# EAGLE board FilterSchematic_REV3 (EAGLE 8.2.2)
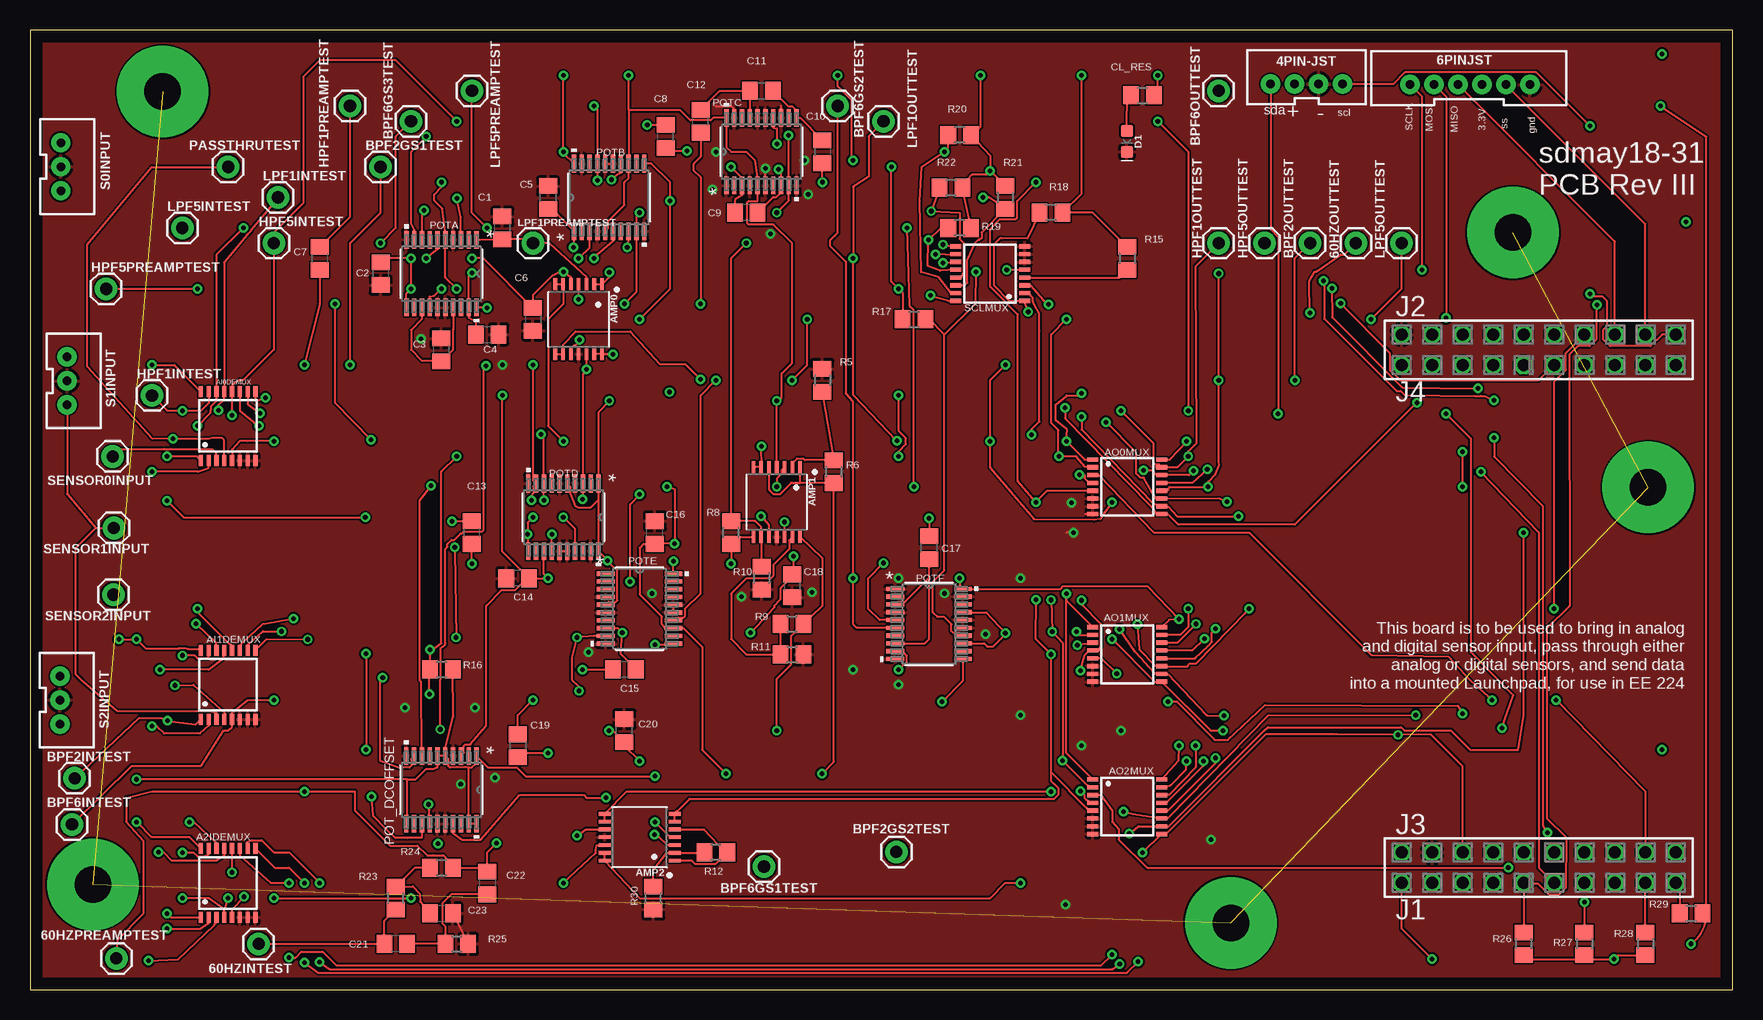
[diagram p2: board, top side]
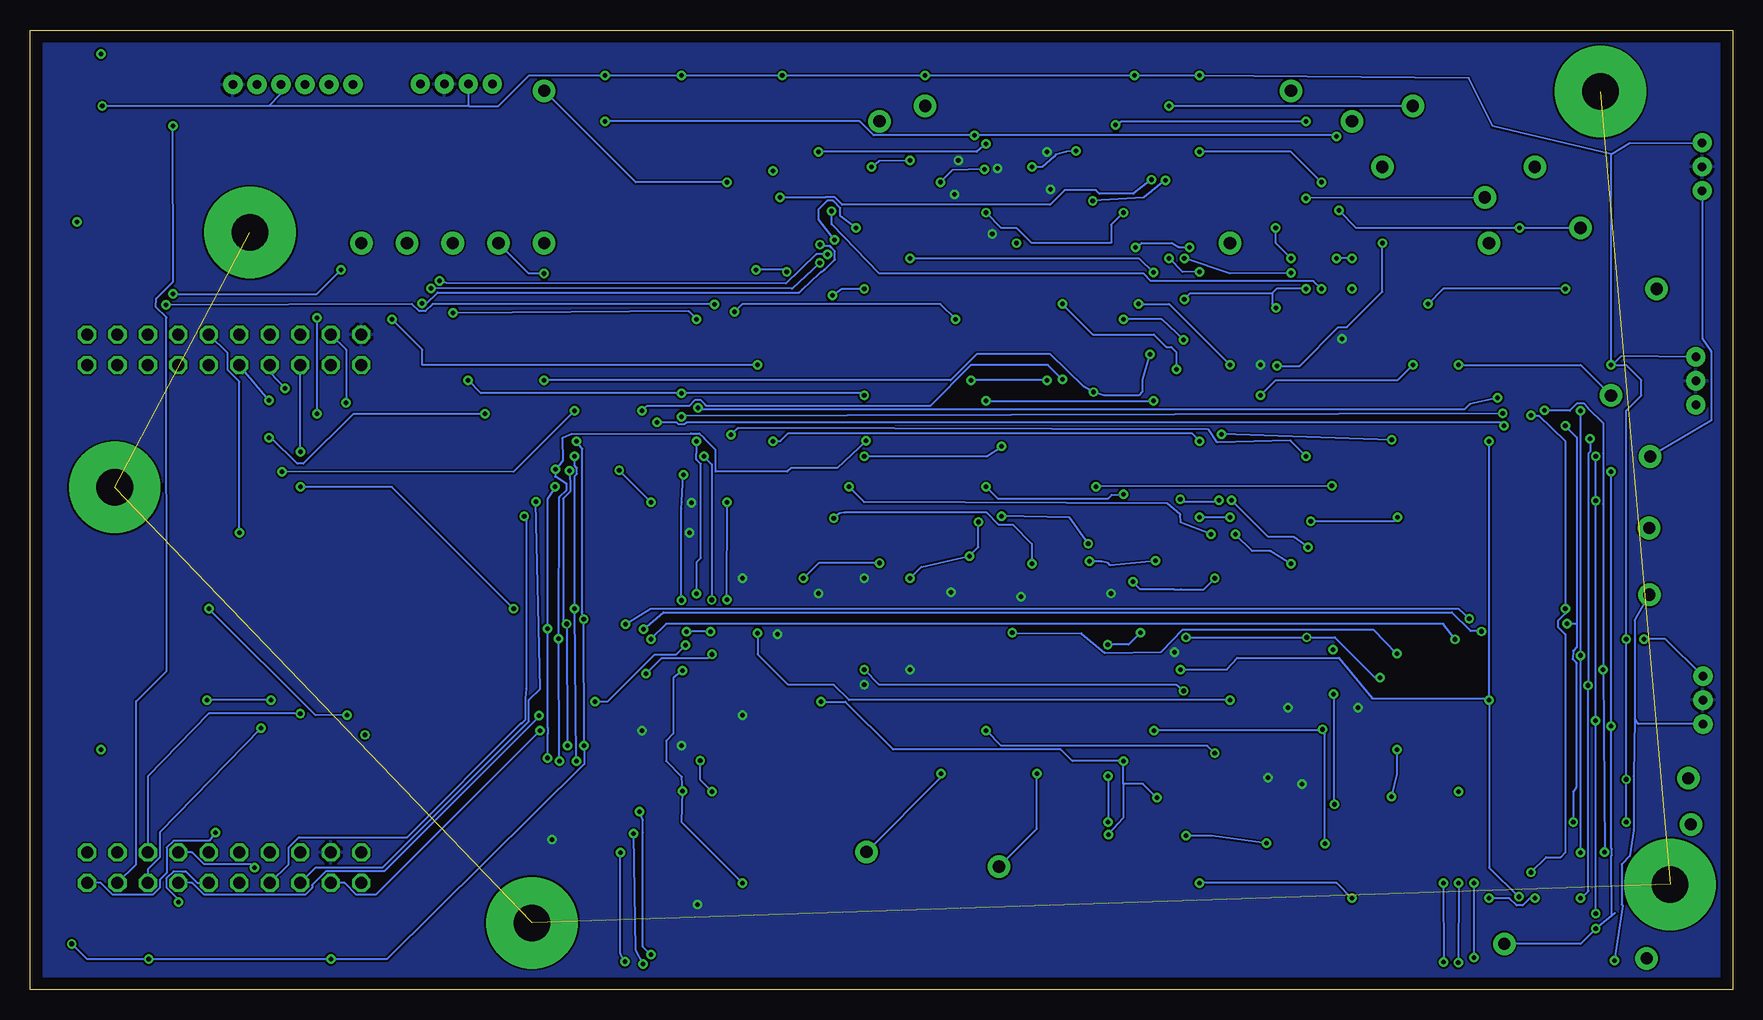
[diagram p3: board, bottom side, seen from below]

Size 141.91 x 80 mm. Coordinates in mm from the lower left corner, seen from the top.
Outline: 0,0 141.91,0 141.91,80 0,80 0,0
Copper layers (1*16): Top 0.035mm / dielectric 1.5mm / Bottom 0.035mm
Design rules "default": minimum track width 6mil, minimum drill 0.35mm, track to track 6mil, track to pad 6mil, pad to pad 6mil, via to via 6mil, smd to smd 6mil, copper to edge 40mil, drill to drill 6mil, minimum pad ring 10mil, minimum via ring 8mil, stop-mask expansion 4mil, vias tented up to drill 0mil, thermal gap 10mil

## Footprints (pad centres in the part's own frame; a part is rotated, then mirrored left to right if it is on the bottom)
1X01 = drill 1.016 pad 1.88: 1 0,0
TSSOP16 = smd 0.9 x 0.35: 1 -2.875,2.275; 2 -2.875,1.625; 3 -2.875,0.975; 4 -2.875,0.325; 5 -2.875,-0.325; 6 -2.875,-0.975; 7 -2.875,-1.625; 8 -2.875,-2.275; 9 2.875,-2.275; 10 2.875,-1.625; 11 2.875,-0.975; 12 2.875,-0.325; 13 2.875,0.325; 14 2.875,0.975; 15 2.875,1.625; 16 2.875,2.275
TSSOP14 = smd 0.305 x 0.991: 1 -1.95,-2.918; 2 -1.3,-2.918; 3 -0.65,-2.918; 4 0,-2.918; 5 0.65,-2.918; 6 1.3,-2.918; 7 1.95,-2.918; 8 1.95,2.918; 9 1.3,2.918; 10 0.65,2.918; 11 0,2.918; 12 -0.65,2.918; 13 -1.3,2.918; 14 -1.95,2.918
C0805 = smd 1.3 x 1.5: 1 -0.95,0; 2 0.95,0
R0805 = smd 1.3 x 1.5: 1 -0.95,0; 2 0.95,0
LED-0603 = smd 1 x 1: A -0.877,0; C 0.877,0
RU_20 = smd 1.473 x 0.356: 1 -2.819,2.925; 2 -2.819,2.275; 3 -2.819,1.625; 4 -2.819,0.975; 5 -2.819,0.325; 6 -2.819,-0.325; 7 -2.819,-0.975; 8 -2.819,-1.625; 9 -2.819,-2.275; 10 -2.819,-2.925; 11 2.819,-2.925; 12 2.819,-2.275; 13 2.819,-1.625; 14 2.819,-0.975; 15 2.819,-0.325; 16 2.819,0.325; 17 2.819,0.975; 18 2.819,1.625; 19 2.819,2.275; 20 2.819,2.925
JST-3-PTH-VERT = drill 0.7 pad 1.6: 1 -2,-0.55; 2 0,-0.55; 3 2,-0.55
JST-6-PTH-VERT = drill 0.7 pad 1.6: 1 -3,-0.55; 2 -1,-0.55; 3 1,-0.55; 4 3,-0.55; 5 4.999,-0.547; 6 6.999,-0.547
JST-4-PTH-VERT = drill 0.7 pad 1.6: 1 -3,-0.55; 2 -1,-0.55; 3 1,-0.55; 4 3,-0.55
SSW-110-02-S-D = drill 1 pad 1.5 octagon: 1 -22.86,11.43; 2 -20.32,11.43; 3 -22.86,8.89; 4 -20.32,8.89; 5 -22.86,6.35; 6 -20.32,6.35; 7 -22.86,3.81; 8 -20.32,3.81; 9 -22.86,1.27; 10 -20.32,1.27; 11 -22.86,-1.27; 12 -20.32,-1.27; 13 -22.86,-3.81; 14 -20.32,-3.81; 15 -22.86,-6.35; 16 -20.32,-6.35; 17 -22.86,-8.89; 18 -20.32,-8.89; 19 -22.86,-11.43; 20 -20.32,-11.43; 21 20.32,11.43; 22 22.86,11.43; 23 20.32,8.89; 24 22.86,8.89; 25 20.32,6.35; 26 22.86,6.35; 27 20.32,3.81; 28 22.86,3.81; 29 20.32,1.27; 30 22.86,1.27; 31 20.32,-1.27; 32 22.86,-1.27; 33 20.32,-3.81; 34 22.86,-3.81; 35 20.32,-6.35; 36 22.86,-6.35; 37 20.32,-8.89; 38 22.86,-8.89; 39 20.32,-11.43; 40 22.86,-11.43

## Placement (x,y rotation side)
60HZINTEST  [1X01]  19.05,3.81 180 top
60HZOUTTEST  [1X01]  110.49,62.23 90 top
60HZPREAMPTEST  [1X01]  7.19,2.6 90 top
A2IDEMUX  CD74HC4051-Q1  [TSSOP16]  16.51,8.89 90 top
AI0DEMUX  CD74HC4051-Q1  [TSSOP16]  16.51,46.99 90 top
AI1DEMUX  CD74HC4051-Q1  [TSSOP16]  16.51,25.4 90 top
AMP0  OPA4830  [TSSOP14]  45.72,55.88 180 top
AMP1  OPA4830  [TSSOP14]  62.23,40.64 180 top
AMP2  OPA4830  [TSSOP14]  50.8,12.7 90 top
AO0MUX  CD74HC4051-Q1  [TSSOP16]  91.44,41.91 0 top
AO1MUX  CD74HC4051-Q1  [TSSOP16]  91.44,27.94 0 top
AO2MUX  CD74HC4051-Q1  [TSSOP16]  91.44,15.24 0 top
BPF2GS1TEST  [1X01]  29.21,68.58 0 top
BPF2GS2TEST  [1X01]  72.2,11.47 0 top
BPF2INTEST  [1X01]  3.72,17.61 90 top
BPF2OUTTEST  [1X01]  106.68,62.23 90 top
BPF6GS1TEST  [1X01]  61.17,10.25 0 top
BPF6GS2TEST  [1X01]  67.31,73.66 0 top
BPF6GS3TEST  [1X01]  31.75,72.39 0 top
BPF6INTEST  [1X01]  3.5,13.76 90 top
BPF6OUTTEST  [1X01]  99.06,74.93 90 top
C1  68n  [C0805]  39.37,63.5 90 top
C2  68n  [C0805]  29.21,59.69 270 top
C3  68n  [C0805]  34.29,53.34 90 top
C4  68n  [C0805]  38.1,54.61 0 top
C5  68n  [C0805]  43.18,66.04 90 top
C6  68n  [C0805]  41.91,55.88 270 top
C7  130n  [C0805]  24.13,60.96 270 top
C8  130n  [C0805]  52.96,71.12 90 top
C9  130n  [C0805]  59.69,64.77 180 top
C10  130n  [C0805]  66.04,69.85 270 top
C11  130n  [C0805]  60.96,74.93 0 top
C12  130n  [C0805]  55.88,72.39 90 top
C13  91n  [C0805]  36.83,38.1 90 top
C14  91n  [C0805]  40.64,34.29 180 top
C15  91n  [C0805]  49.53,26.67 180 top
C16  91n  [C0805]  52.07,38.1 90 top
C17  91n  [C0805]  74.93,36.83 90 top
C18  91n  [C0805]  63.5,33.66 270 top
C19  91n  [C0805]  40.64,20.32 270 top
C20  18n  [C0805]  49.53,21.59 90 top
C21  5.6u  [C0805]  30.48,3.81 180 top
C22  5.6u  [C0805]  38.1,8.89 270 top
C23  10u  [C0805]  34.29,6.35 0 top
CL_RES  120  [R0805]  92.71,74.55 0 top
D1  Ind  [LED-0603]  91.41,70.71 270 top
HPF1INTEST  [1X01]  10.16,49.53 0 top
HPF1OUTTEST  [1X01]  99.06,62.23 90 top
HPF1PREAMPTEST  [1X01]  26.67,73.66 0 top
HPF5INTEST  [1X01]  20.32,62.23 0 top
HPF5OUTTEST  [1X01]  102.87,62.23 90 top
HPF5PREAMPTEST  [1X01]  6.35,58.42 0 top
LPF1INTEST  [1X01]  20.67,66.04 0 top
LPF1OUTTEST  [1X01]  71.12,72.39 0 top
LPF1PREAMPTEST  [1X01]  41.91,62.23 0 top
LPF5INTEST  [1X01]  12.7,63.5 0 top
LPF5OUTTEST  [1X01]  114.3,62.23 90 top
LPF5PREAMPTEST  [1X01]  36.83,74.93 0 top
PASSTHRUTEST  [1X01]  16.51,68.58 0 top
POT_DCOFFSET  AD5254BRUZ10-RL7  [RU_20]  34.28,16.65 270 top
POTA  AD5254BRUZ10-RL7  [RU_20]  34.29,59.69 270 top
POTB  AD5254BRUZ10-RL7  [RU_20]  48.26,66.04 90 top
POTC  AD5254BRUZ10-RL7  [RU_20]  60.96,69.85 90 top
POTD  AD5254BRUZ10-RL7  [RU_20]  44.45,39.37 270 top
POTE  AD5254BRUZ10-RL7  [RU_20]  50.8,31.75 0 top
POTF  AD5254BRUZ10-RL7  [RU_20]  74.93,30.48 0 top
R5  1k  [R0805]  66.04,50.8 270 top
R6  2.7k  [R0805]  66.99,43.18 90 top
R8  3.3K  [R0805]  58.42,38.1 90 top
R9  2.7k  [R0805]  63.5,30.48 0 top
R10  1k  [R0805]  60.96,34.29 270 top
R11  1k  [R0805]  63.5,27.94 0 top
R12  2.7k  [R0805]  57.15,11.43 180 top
R15  1k  [R0805]  91.44,60.96 270 top
R16  1k  [R0805]  34.29,26.67 180 top
R17  1k  [R0805]  73.66,55.88 0 top
R18  1k  [R0805]  85.09,64.77 180 top
R19  1k  [R0805]  77.47,63.5 180 top
R20  1k  [R0805]  77.47,71.25 180 top
R21  1k  [R0805]  81.28,66.04 270 top
R22  1k  [R0805]  76.76,66.84 180 top
R23  470  [R0805]  30.48,7.62 90 top
R24  470  [R0805]  34.29,10.16 0 top
R25  220  [R0805]  35.56,3.81 0 top
R26  1k  [R0805]  124.46,3.81 270 top
R27  1k  [R0805]  129.54,3.81 270 top
R28  1k  [R0805]  134.62,3.81 270 top
R29  1k  [R0805]  138.43,6.35 0 top
R30  1k  [R0805]  51.94,7.62 90 top
S0INPUT  [JST-3-PTH-VERT]  3.12,68.6 270 top
S1INPUT  [JST-3-PTH-VERT]  3.64,50.74 270 top
S2INPUT  [JST-3-PTH-VERT]  3.05,24.13 270 top
SCLMUX  CD74HC4051-Q1  [TSSOP16]  80.01,59.69 180 top
SENSOR0INPUT  [1X01]  6.89,44.44 180 top
SENSOR1INPUT  [1X01]  6.99,38.48 180 top
SENSOR2INPUT  [1X01]  6.96,32.92 180 top
U$1  6PINJST  [JST-6-PTH-VERT]  118,76 0 top
U$2  4PIN-JST  [JST-4-PTH-VERT]  106.38,76.05 0 top
U$4  LAUNCHPAD_FOOTPRINT  [SSW-110-02-S-D]  125.73,31.75 90 top

## Tracks (layer width: path | path; a pad name or v marks a point on that pad's centre or on a via)
3.3V  (via drill 0.38)
  Top 0.152: A2IDEMUX.16 13.3,12.7 10.16,12.7 v8.89,13.97 | 8.91,29.19 v8.89,29.21 | 8.91,29.19 9.64,28.46 12.43,28.46 12.44,28.47 12.96,28.47 13.16,28.41 14.11,28.41 AI1DEMUX.16 | v10.16,52.07 12.03,52.07 AI0DEMUX.16 | v135.89,73.66 139.7,71.12 139.7,6.35 | 139.7,6.35 arc-53 v138.43,3.81 | v116.84,2.54 114.3,5.08 U$4.1 | 31.43,17.52 32.16,17.52 33.02,18.39 33.04,18.36 33.59,18.36 33.96,18.51 POT_DCOFFSET.6 POT_DCOFFSET.5 | 31.43,17.52 v8.89,17.52 | v52.07,17.78 41.3,17.78 40.59,18.49 38.18,18.49 POT_DCOFFSET.1 37.2,19.43 37.2,18.85 36.83,18.5 36.54,18.5 | v52.07,13.97 53.34,12.7 AMP2.4 | POTB.20 44.45,69.74 v44.45,69.85 v44.45,76.2 | 49.88,73.31 v49.88,76.2 | 49.88,73.31 POTB.13 49.88,67.67 49.53,67.31 49.53,65.4 48.18,64.05 48.18,63.46 POTB.5 | AO0MUX.16 94.98,44.19 v96.38,45.7 | v95.74,20.32 95.7,19.08 AO2MUX.16 | AO1MUX.16 94.92,30.82 v95.77,30.87 93.11,33.63 86.11,33.63 85.89,33.41 POTF.20 77.47,33.68 v77.47,34.29 | CL_RES.2 93.98,75.25 v93.98,76.2 | v79.22,76.2 79.22,71.92 R20.1 80.01,69.53 v80.01,68.26 | v87.63,76.2 87.63,66.36 R18.1 88.58,64.77 R15.1 | R19.1 R22.1 78.13,67.07 78.13,67.57 78.49,67.93 79.68,67.93 v80.01,68.26 | v38.08,56.85 POTA.20 | v45.72,57.54 AMP0.4 | v35.56,58.42 34.62,59.37 POTA.5 34.64,62.9 34.37,65.1 33.68,65.79 33.68,66.29 34.29,66.9 v34.29,67.31 | 124.47,2.85 R26.2 124.78,2.54 129.55,2.54 129.54,2.55 R27.2 129.86,2.54 v132.01,2.54 132.34,2.86 R28.2 134.56,2.79 | R16.1 35.29,22.81 34.63,20.21 34.62,19.57 34.62,19.49 POT_DCOFFSET.5 | 49.88,73.31 54.18,73.31 55.03,72.46 56.73,72.46 56.93,72.67 POTC.20 58.03,70.23 58.42,69.85 59.69,69.85 60.39,69.15 60.64,67.38 POTC.5 60.63,65.75 59.9,65.75 59.76,65.61 59.76,63.92 59.9,63.79 61.94,63.79 63.5,62.23 63.5,52.24 62.63,51.37 62.63,49.37 v62.23,49.08 AMP1.4
  Top 0.152: POTD.1 | POTD.1 47.38,40.82 | 47.38,40.82 POTD.20 47.98,35.95 v48.11,35.75 48.78,35.08 48.81,35.08 48.95,34.95 48.95,32.45 48.81,32.32 48.22,32.32 POTE.5 | POTD.5 45.02,41.95 45.02,41.36 45.43,40.31 45.71,40.19 46.72,40.19 47.38,40.82 | v48.27,49.08 47.38,48.08 POTD.1 | POTF.5 70.8,30.8 69.85,31.75 69.85,34.29 v71.12,35.56 | SCLMUX.16 76.89,57.38 76.59,57.38 75.22,57.76 v75.05,57.86 | R17.1 72.71,58.1 v72.39,58.42 71.78,59.03 v71.78,68.58 | v67.31,76.2 67.31,75.31 68.48,74.14 68.48,69.34 v68.58,69.13 | R21.1 v80.01,68.26 | R29.2 139.7,6.35 | v7.41,29.21 7.64,29.19 8.91,29.19 | POT_DCOFFSET.20 POT_DCOFFSET.19 36.54,13.84 36.54,18.5 | POT_DCOFFSET.5 34.85,19.23 34.85,18.64 34.98,18.5 36.54,18.5 | POTE.20 v53.62,35.69 | POT_DCOFFSET.11 31.43,13.9 31.43,17.52
  Bottom 0.152: v8.89,13.97 v8.89,17.52 v8.89,29.21 8.89,48.26 7.62,49.53 7.62,50.8 8.89,52.07 10.04,52.07 | 10.04,52.07 v10.16,52.07 10.16,69.66 | v138.43,3.81 137.16,2.54 v132.01,2.54 v116.84,2.54 112.17,2.54 95.72,18.79 v95.74,20.32 v95.77,30.87 95.91,31.46 95.89,31.49 95.89,45.09 v96.38,45.7 | v52.07,17.78 v52.07,13.97 | v62.23,49.08 v48.27,49.08 | v71.12,35.56 76.2,35.56 v77.47,34.29 | v75.05,57.86 74.27,58.42 v72.39,58.42 | v71.78,68.58 71.14,69.09 v68.58,69.13 | v34.29,67.31 36.83,69.85 v44.45,69.85 | v48.11,35.75 51.88,35.37 52.07,35.56 52.6,35.69 v53.62,35.69 | 38.39,58.05 45.21,58.05 v45.72,57.54 | v35.56,58.42 38.02,58.42 38.39,58.05 | 38.39,58.05 38.39,57.16 v38.08,56.85 | 105.31,73.66 122.01,73.66 | 105.31,73.66 102.87,73.66 100.33,76.2 v93.98,76.2 v87.63,76.2 v79.22,76.2 v67.31,76.2 v49.88,76.2 v44.45,76.2 22,76 20,72 10.16,69.66 | 122.01,73.66 v135.89,73.66 | S2INPUT.1 5.62,29.21 v7.41,29.21 | S1INPUT.1 9.31,52.8 10.04,52.07 | S0INPUT.1 8.63,70.58 10.16,69.66 | U$1.4 121,74.67 122.01,73.66 | U$2.2 105.38,73.72 105.31,73.66
60HZIN  (via drill 0.38)
  Top 0.152: v10.16,43.18 14,43.18 14.88,43.5 AI0DEMUX.2 | A2IDEMUX.2 14.89,5.8 14.89,5.5 14.25,5.08 v11.43,5.08 | AI1DEMUX.2 14.87,22.35 14.91,22.02 14.15,21.35 11.18,21.35 10.57,21.94 v10.16,21.96 | 60HZINTEST.1 C21.2 29.53,5.72 R23.1
  Bottom 0.152: 9.84,6.37 10.12,6.14 | 10.12,6.14 v11.43,5.08 12.7,3.81 60HZINTEST.1 | v10.16,43.18 v10.16,21.96 10.13,11.77 10.08,11.71 10.08,11.2 10.13,11.15 10.12,6.14
60HZOUT  (via drill 0.38)
  Top 0.152: AO0MUX.2 88.4,43.57 87.95,43.57 87.2,44.45 v85.75,44.45 85.7,44.51 85.7,46.63 85.09,47.24 85.09,54.61 v86.36,55.88 | v85.1,32.48 v85.19,29.84 86.06,28.91 v86.06,19.08 88.02,17.11 88.51,16.84 AO2MUX.2 | AMP2.9 AMP2.8 49.74,16.51 v85.09,16.51 | v87.2,29.82 87.33,29.57 AO1MUX.2 | 60HZOUTTEST.1 109.54,61.28 109.22,61.28 107.17,59.87 107.08,59.84 106.6,59.07 v106.65,56.41
  Bottom 0.152: v85.75,44.45 85.09,43.79 v85.1,32.48 | v85.09,16.51 86.06,17.48 v86.06,19.08 | v86.36,55.88 87.02,56.54 v106.65,56.41 | v85.19,29.84 87.18,29.84 v87.2,29.82
A0S0  (via drill 0.38)
  Top 0.152: AI0DEMUX.11 17.49,48.28 v19.07,46.98 | AO0MUX.11 94.02,40.94 | 94.02,40.94 94.04,40.91 99.1,40.94 v99.75,40.66 | 94.02,40.94 93.88,40.87 93.47,41.49 92.83,42.66 92.55,42.66 92.19,43.02 92.19,44.79 v89.67,47.3
  Bottom 0.152: U$4.5 118.09,10.18 112.52,10.18 100.33,22.37 100.33,24.13 99.41,25.05 v99.75,40.66 | v89.67,47.3 88.06,47.3 87.89,47.13 87.37,47.13 87.2,47.3 19.39,47.3 v19.07,46.98
A0S1  (via drill 0.38)
  Top 0.152: AI0DEMUX.10 18.14,48.81 v19.18,48.04 | v87.63,47.76 87.63,46.67 93.59,40.54 94.09,40.31 AO0MUX.10 94.56,40.27 94.86,40.27 95.59,39.45 v100.72,39.44
  Bottom 0.152: v19.18,48.04 87.47,47.81 v87.63,47.76 | v100.72,39.44 100.56,39.38 100.56,25.1 100.64,24.26 100.64,22.49 100.93,22.19 101,22.19 110.49,12.7 119.5,12.7 120.36,11.84 120.36,10.45 U$4.7
A0S2  (via drill 0.38)
  Top 0.152: AI0DEMUX.9 18.79,49.07 v19.62,49.33 | v86.26,48.51 86.26,47.61 93.3,40.4 93.64,40.02 93.85,39.65 94.15,39.65 AO0MUX.9 94.83,39.63 95.7,38.76 105.41,38.76 v115.57,48.92
  Bottom 0.152: v19.62,49.33 21.93,48.81 22.38,48.36 86.26,48.36 v86.26,48.51 | U$4.24 115.57,53.34 v115.57,48.92
A1S0  (via drill 0.38)
  Top 0.152: AI1DEMUX.11 17.49,28.7 17.73,28.94 19.4,30.49 v21.97,30.92 | v92.28,30.45 92.45,28.37 93.72,27.02 94.04,27 AO1MUX.11 94.54,26.96 96.5,26.96 96.62,27.19 97.18,27.19 101.34,31.47 101.34,31.49 v101.6,31.75 | v119.38,41.91 v119.38,44.83
  Bottom 0.152: v21.97,30.92 22.86,31.75 90.17,31.75 v92.28,30.45 | v101.6,31.75 111.76,41.91 v119.38,41.91 | v119.38,44.83 U$4.25
A1S1  (via drill 0.38)
  Top 0.152: AI1DEMUX.10 18.14,28.73 19.41,29.87 19.41,29.85 v20.95,29.85 | v99.49,22.83 98.07,22.86 94.82,26.31 94.52,26.31 AO1MUX.10 94.03,26.36 93.73,26.36 92.1,28.16 v90.79,30.04
  Bottom 0.152: v20.95,29.85 20.98,29.88 21.85,29.88 23.41,31.45 89.13,31.45 v90.79,30.04 | U$4.13 128.39,8.89 127.41,7.91 118.97,7.91 118.4,8.48 118.4,8.72 117.25,9.87 112.39,9.87 99.49,22.78 v99.49,22.83
A1S2  (via drill 0.38)
  Top 0.152: AI1DEMUX.9 19.72,29.21 v23.14,29.19 | v90.17,29.21 93.72,25.66 AO1MUX.9 98.39,21.59 v99.41,21.59
  Bottom 0.152: v23.14,29.19 24.13,30.48 88.9,30.48 v90.17,29.21 | U$4.3 115.69,8.89 114.71,7.91 113.09,7.91 v99.41,21.59
A2S0  (via drill 0.38)
  Top 0.152: A2IDEMUX.11 17.47,11.5 17.48,11.2 20.06,8.89 v21.59,8.89 | v21.59,2.66 22.13,2.66 22.61,3.15 24.38,3.15 25.52,2.01 89.26,2.01 v90.17,2.91 | v91.12,14.83 91.89,14.63 AO2MUX.11 94.55,14.31 94.85,14.31 103.21,22.86 v115.48,22.88 | v127,31.75 127,50.68 127.98,51.66 127.98,53.05 U$4.34
  Bottom 0.152: v21.59,8.89 v21.59,2.66 21.59,2.54 | v91.12,14.83 90.85,14.14 90.84,13.06 90.83,3.58 v90.17,2.91 | v115.48,22.88 118.11,22.86 v127,31.75
A2S1  (via drill 0.38)
  Top 0.152: A2IDEMUX.10 18.12,12.31 18.32,12.41 18.52,12.44 19.31,12.44 20.32,11.43 21.59,11.43 v24.13,8.89 | v24.11,2.29 24.97,1.7 90.17,1.7 v90.81,2.12 | v91.61,12.99 92.36,13.62 AO2MUX.10 94.89,13.62 102.87,21.59 103.15,21.87 114.26,21.87 114.53,21.59 118.41,21.59 120,20 124,20 124.46,22.86 v124.46,38.1
  Bottom 0.152: v24.13,8.89 v24.11,2.29 | v90.81,2.12 91.44,3.27 v91.61,12.99 | v124.46,38.1 124.46,50.68 125.44,51.66 125.44,53.05 U$4.32
A2S2  (via drill 0.38)
  Top 0.152: A2IDEMUX.9 20.39,10.16 21.59,10.16 v22.86,8.89 | v22.89,2.23 24,1.4 91.44,1.4 91.42,1.42 v92.34,2.33 | v92.71,11.43 AO2MUX.9 94.54,12.89 94.92,13.21 103,21.29 108.92,21.29 v114.01,21.23 116.74,21.26 119.38,18.62 U$4.6
  Bottom 0.152: v22.86,8.89 v22.89,2.23 | v92.34,2.33 92.71,2.99 v92.71,11.43
AOUT0  (via drill 0.38)
  Top 0.152: AO0MUX.3 88.8,42.88 89.09,42.88 93.65,38.1 101.6,38.1 111.83,27.87 118.21,27.73 120.06,25.75 v121.83,24.14 | v127.17,24.14 134.62,16.51 U$4.18
  Bottom 0.152: v121.83,24.14 v127.17,24.14
AOUT1  (via drill 0.38)
  Top 0.152: AO1MUX.3 88.56,28.85 v87.27,28.72 | v94.82,24.01 95.55,24 98.72,20.8 99.82,20.8 102.92,23.72 118.98,23.66 v119.39,23.01
  Bottom 0.152: v119.39,23.01 127.01,23.01 132.08,17.78 U$4.16 | v87.27,28.72 88.07,27.92 89.87,27.92 93.78,24.01 v94.82,24.01
AOUT2  (via drill 0.38)
  Top 0.152: AO2MUX.3 88.82,16.23 89.23,16.22 90.17,14.91 90.17,13.97 90.74,13.36 90.71,12.49 93.12,10.16 v123.19,10.16
  Bottom 0.152: v123.19,10.16 123.48,10.45 127.41,10.45 128.39,11.43 U$4.14
ATOB  (via drill 0.38)
  Top 0.152: 64.18,42.23 AMP1.1 | 64.18,42.23 R6.1 66.99,18.99 v66,18 | AMP1.5 61.62,43.52 61.62,43.06 61.61,43.05 61.61,41.65 61.97,41.29 62.49,41.29 63.43,42.23 64,42.23 | 63.41,42.23 64,42.23 | 64,42.23 64.18,42.23
  Bottom 0.152: BPF2GS2TEST.1 66,17.67 v66,18
AW0
  Top 0.152: POTA.1 37.5,62.51 C1.1 41.59,62.55 LPF1PREAMPTEST.1 43.26,62.23 46.38,59.39 46.38,59.07 AMP0.3
AW1  (via drill 0.38)
  Top 0.152: C2.1 29.53,60.96 v31.75,60.96 31.76,60.95 v31.76,58.42 31.36,58.02 POTA.11 | POTA.6 33.97,62.3 33.97,61.72 33.02,60.98 v33.02,60.96
  Bottom 0.152: v31.75,60.96 v33.02,60.96
AW2
  Top 0.152: POTA.17 35.27,55.04 35.27,55.03 35.27,53.37 34.33,52.43 | POTA.13 32.66,55.91 31.75,55 31.75,53.34 32.66,52.43 34.33,52.43 | 34.33,52.43 C3.1 33.97,52.39
AW3  (via drill 0.38)
  Top 0.152: C4.1 37.15,55.7 36.55,56.02 36.55,56.61 POTA.19 36.56,59.42 v36.82,59.74 | v45.72,60.96 46.63,61.88 POTB.3
  Bottom 0.152: v36.82,59.74 41.91,59.69 v45.72,60.96
BPF2IN  (via drill 0.38)
  Top 0.152: AI0DEMUX.1 13.9,44.45 v11.43,44.45 | v11.43,6.35 11.77,6.01 A2IDEMUX.1 | AI1DEMUX.1 13.8,22.09 v11.45,22.4 10.95,22.63 10.46,22.64 9.11,22.64 BPF2INTEST.1 | v11.43,40.74 12.8,39.37 v27.94,39.37 | v35.18,39.05 C13.2
  Bottom 0.152: v11.43,44.45 v11.43,40.74 v11.45,22.4 v11.43,6.35 | v27.94,39.37 28.26,39.05 v35.18,39.05
BPF2OUT  (via drill 0.38)
  Top 0.152: AO1MUX.1 86.36,32.42 v86.37,32.99 86.36,19.72 AO2MUX.1 | AO0MUX.1 87.89,44.19 v86.36,45.72 86.42,46.68 85.49,47.42 85.49,48.76 86.36,49.47 86.36,49.53 87.44,49.53 v87.63,49.72 | v105.41,50.8 105.41,60.96 BPF2OUTTEST.1 | AMP1.7 AMP1.6 60.96,43.59 v60.95,45.27 | v72.39,44.45 72.39,44.86 73,45.47 73,45.97 72.39,46.58 v72.39,49.53
  Bottom 0.152: v105.41,50.8 104.33,49.72 v87.63,49.72 72.58,49.72 v72.39,49.53 | v60.95,45.27 62.23,44.45 v72.39,44.45 | v86.37,32.99 86.37,35.63 86,36 86,43.82 86.38,44.19 86.38,44.71 86.36,44.72 v86.36,45.72
BPF6IN  (via drill 0.38)
  Top 0.152: A2IDEMUX.5 16.84,6.67 v17.83,7.73 | v20.32,45.72 18.14,45.72 17.47,45.73 16.84,45.04 AI0DEMUX.5 | v20.32,24.13 18.14,24.13 16.83,23.08 16.83,22.78 AI1DEMUX.5 16.84,21.91 16.51,21.59 16.16,21.59 14.27,18.64 8.48,18.64 BPF6INTEST.1 | v46.04,26.67 C15.2
  Bottom 0.152: v17.83,7.73 20.32,10.16 v20.32,24.13 20.32,24.25 | 20.32,24.25 v20.32,45.72 | 20.32,24.25 30.06,24.25 32.84,27.66 41.31,27.66 42.17,26.67 v46.04,26.67
BPF6OUT  (via drill 0.38)
  Top 0.152: AO2MUX.5 88.32,14.89 88.02,15.16 85.09,18.09 | 85.09,18.09 v85.09,27.94 83.82,29.21 v83.84,32.49 | AO0MUX.5 84.77,41.59 v83.82,40.64 82.33,42.39 82.33,56.28 80.01,58.6 80.01,63.39 80.83,64.21 82.12,64.21 82.26,64.34 82.26,65.75 v83.82,67.31 | AMP2.6 AMP2.7 | AMP2.7 53.99,14.92 | 85.09,18.09 85.09,17.37 85.33,17.13 85.35,17.13 85.71,16.77 85.71,16.25 85.35,15.89 84.83,15.89 84.82,15.9 54.97,15.9 AMP2.7 | v90.56,26.34 89.29,27.61 AO1MUX.5
  Bottom 0.152: v85.09,27.94 85.42,27.61 89.29,27.61 v90.56,26.34 | v83.84,32.49 v83.82,40.64 | v83.82,67.31 91.44,67.31 BPF6OUTTEST.1
BW0  (via drill 0.38)
  Top 0.152: POTB.8 49.94,63.05 v49.77,61.88 | v45.28,61.89 POTB.1 43.47,65.09 C5.1
  Bottom 0.152: v49.77,61.88 49.28,62.23 46.74,62.23 46.17,61.91 v45.28,61.89
BW1  (via drill 0.38)
  Top 0.152: POTB.6 48.56,63.06 48.59,62.41 46.99,61.04 v46.99,60.96 | AMP0.5 45.07,59.08 45.07,59.4 44.6,59.79 v44.46,59.85 44.1,59.83 43.52,59.52 41.91,57.91 C6.1 37.78,60.96 v36.83,60.96 | v38.1,63.5 36.83,64.77 LPF5PREAMPTEST.1
  Bottom 0.152: v36.83,60.96 38.1,62.23 v38.1,63.5 | v44.46,59.85 45.85,59.82 v46.99,60.96
CA0  (via drill 0.38)
  Top 0.152: v58.42,68.58 59.34,67.67 POTC.3 59.34,66.82 59.34,66.23 58.74,65.85 C9.2 | v54.74,69.92 53.59,69.92 C8.1
  Bottom 0.152: v54.74,69.92 55.56,69.85 56.44,69.62 56.55,69.44 57.56,68.58 v58.42,68.58
CA1  (via drill 0.38)
  Top 0.152: C9.1 61.94,66.06 62.21,66.06 62.59,66.44 POTC.8 62.59,68.05 v62.39,68.39 | v66.04,67.31 C10.2
  Bottom 0.152: v62.39,68.39 65.06,68.29 v66.04,67.31
CA2
  Top 0.152: C10.1 64.17,72.67 POTC.11 63.88,73.26 63.51,73.64 63.2,73.64 C11.2
CA3
  Top 0.152: POTC.17 59.98,74.91 C11.1 57.47,74.93 C12.2
DRAINA
  Top 0.152: AMP1.2 63.53,43.88 63.93,44.28 64.43,44.28 64.58,44.13 R6.2 66.04,49.74 R5.2 66.04,50.03
DW2  (via drill 0.38)
  Top 0.152: POTD.13 42.83,34.65 v43.18,34.29 C14.1 | C14.1 39.37,36.51 v39.37,49.53 | v26.67,52.07 26.67,62.23 29.21,64.77 BPF2GS1TEST.1 | AMP1.3 62.61,43.29 62.61,42.97 62.23,42.59 v62.23,41.91 | POT_DCOFFSET.3 36.15,19.76 36.15,20.3 36.28,20.43 36.7,20.43 38,22 38,32 39.31,33.31 40.44,33.31 41.41,34.29 C14.1 | v50,34 50,40.45 v50.8,41.28
  Bottom 0.152: v43.18,34.29 44.09,33.38 46,33.38 46.59,33.38 49.38,33.38 v50,34 | v39.37,49.53 38.1,50.8 27.94,50.8 v26.67,52.07 | v62.23,41.91 61.27,40.95 52.07,40.95 51.77,41.25 v50.8,41.28
EA1  (via drill 0.38)
  Top 0.152: POTE.8 48.99,30.12 v49.36,29.75 49.25,27.98 C15.1 | v52.09,28.77 53.56,28.77 POTE.11
  Bottom 0.152: v49.36,29.75 50.35,28.77 v52.09,28.77
EW2  (via drill 0.38)
  Top 0.152: v60.93,39.46 61.58,38.75 AMP1.10 | POT_DCOFFSET.8 32.59,25.64 32.46,25.82 32.46,40.78 v33.43,42 | v53.08,41.93 53.72,41.72 v53.72,37.18 52.1,37.18 C16.1 51.12,37.15 50.8,36.83 50.8,32.94 52.07,31.67 52.68,31.07 52.65,31.05 52.65,30.5 53,30.08 53.43,30.12 POTE.13 53.65,30.15 54.17,30.15 54.42,30.14 56,28.56 56,20 v58,18
  Bottom 0.152: v53.72,37.18 55.28,39.37 v60.93,39.46 | v33.43,42 v53.08,41.93 | BPF6GS1TEST.1 58,13.41 v58,18
FA3  (via drill 0.38)
  Top 0.152: C19.1 40.64,22.86 v41.91,24.13 | POTF.17 79.7,31.45 v81.27,29.71 81.28,29.62 80.26,28.6 79.76,28.6 79.51,28.86 POTF.13
  Bottom 0.152: v41.91,24.13 73.66,24.13 74.93,25.4 78.74,25.4 81.28,27.94 v81.27,29.71
FW1  (via drill 0.38)
  Top 0.152: AMP1.12 v62.88,38.98 | POTF.6 68.91,30.16 68.58,30.48 v68.58,34.29 68.55,49.03 67.97,49.71 67.97,60.69 | BPF6GS2TEST.1 67.31,63.09 67.07,62.85 67.05,62.85 66.69,62.49 66.69,61.97 67.97,60.69 | 67.97,60.71 67.97,60.69 | v63.63,36.13 63.63,34.73 C18.1 63.5,34.43 62.52,33.45 62.52,32.52 62,32 62,31.87 v60.06,29.73 | 32.66,14.04 POT_DCOFFSET.13 32.66,12.66 31.46,12.64 31.09,12.64 30.94,12.64 30.46,12.64 29.7,13.35 28.6,14.47 v28.46,16.07 | v28,28 v28,20
  Bottom 0.152: v68.58,34.29 67.63,35.24 v63.63,36.13 62.88,36.88 v62.88,38.98 | v60.06,29.73 54.3,29.71 52.33,28.06 47.63,28.16 45.84,30.01 29.98,30.01 v28,28 | v28,20 28,18 v28.46,16.07
GND  (via drill 0.38)
  Top 0.152: C23.2 R25.2 | POTB.16 POTB.15 | POTD.15 POTD.16 | POTE.16 POTE.15 | AO0MUX.8 87.97,39.63 | v86.97,38.1 86.36,38.1 | POTC.6 | POTC.6 v61.28,68.45 | POTC.13 | POTC.13 62.59,73.68 | 57.15,73.66 58.42,73.66 58.69,73.39 POTC.19
  other vias: 86.78,40.58 39.37,52.07 51.82,33.02 68.58,26.67 72.39,25.4 79.61,29.64 72.39,34.29 82.55,34.29 82.55,22.86 90.9,21.59 87.63,20.32 32.57,54.26 46.53,28.11 59.31,32.77 31.24,23.5 37.08,23.5 56.87,66.71 57.15,69.85 64.85,66.28 61.72,62.99 76.2,33.02 35.9,17.13 38.73,17.65 64.55,69.13 86.29,7.1 98.42,12.5 65.16,33.13
  pour Top: 0,80.01 142.24,80.01 142.24,0 0,0
  pour Bottom: 0,80.01 142.24,80.01 142.24,0 0,0
GW0  (via drill 0.38)
  Top 0.152: AMP2.3 53.48,12.03 53.16,12.03 52.38,12.72 v52.04,12.92 | v50.8,19.05 49.53,20.32 C20.1 48.58,21.59 v48.26,21.59 | v29.21,62.23 30.49,63.51 30.49,71.13 BPF6GS3TEST.1 | v48,16 46.36,16 46.15,16.22 40.83,16.22 37.55,12.49 37,12.49 37.01,12.49 36.71,12.49 36,12.5 35.25,13.05 35.25,13.64 POT_DCOFFSET.17 | POTF.11 77.75,25.75 v76,24 | v34.19,21.69 34.19,25.79 34.22,25.82 34.22,28.44 34.42,28.59 34.49,28.66 34.57,28.72 34.58,28.75 34.59,28.76 34.61,28.86 34.61,36.75 34.77,36.91 34.77,37.13 35.14,37.5 35.36,37.5 35.89,38.03 36,38.03 36.14,38.17 37.67,38.17 37.81,38.3 37.81,51.81 v38,52
  Bottom 0.152: v52.04,12.92 50.8,14.33 50.8,17.16 | 50.8,17.16 v50.8,19.05 55.05,19.05 56.02,20.02 69.98,20.02 73.96,24 v76,24 | 34.3,21.59 v34.19,21.69 | 34.3,21.59 v48.26,21.59 | v29.21,62.23 29.21,58.17 32.16,55.22 32.89,55.22 36.11,52 v38,52 | v34,12.16 34,21.3 34.3,21.59 | v48,16 49.16,17.16 50.8,17.16
HPF1IN  (via drill 0.38)
  Top 0.152: A2IDEMUX.15 14.88,11.52 14.89,11.26 14.51,11.09 13.96,11.09 13.62,11.43 v12.7,11.43 | AI1DEMUX.15 14.9,27.98 14.84,27.6 14.58,27.6 13.96,27.6 13.71,27.85 v12.7,27.85 | HPF1INTEST.1 11.43,48.26 v12.7,48.26 14.26,48.26 14.88,48.88 AI0DEMUX.15 | C7.2 24.13,57.15 v22.86,52.07
  Bottom 0.152: v12.7,48.26 v12.7,27.85 12.7,27.32 12.7,27.31 12.7,27.19 12.7,25.61 12.7,25.1 12.68,25.08 12.68,13.71 12.7,13.7 v12.7,11.43 | v22.86,52.07 12.7,52.07 HPF1INTEST.1
HPF1OUT  (via drill 0.38)
  Top 0.152: AO2MUX.15 95.06,17.03 96.34,18.35 v96.37,19.05 | v96.52,31.75 96.52,30.25 95.84,29.57 AO1MUX.15 | AO0MUX.15 95.61,43.53 v96.52,44.45 96.52,44.86 97.21,45.56 97.13,60.3 HPF1OUTTEST.1 | AMP0.8 AMP0.9 44.42,53.17 44.42,53.75 45.46,54.85 50.03,54.85 52.49,52.14 54.6,52.14 v55.88,50.87 55.88,51.12 | 93.81,43.58 94.11,43.58 AO0MUX.15 | AO0MUX.15 94.07,43.78 93.77,43.78 93.64,43.91 93.64,45.52 v90.9,48.26
  Bottom 0.152: v96.37,19.05 v96.52,31.75 96.52,42.8 96.33,42.98 96.33,43.5 96.52,43.68 v96.52,44.45 | v55.88,50.87 57.08,52.07 59.69,52.07 | 59.69,52.07 | 59.69,52.07 63.5,52.07 66.9,48.67 85.56,48.67 85.64,48.74 85.64,48.76 86,49.13 86.52,49.13 86.98,48.67 90.49,48.67 v90.9,48.26
HPF5IN  (via drill 0.38)
  Top 0.152: AI1DEMUX.12 16.84,28.64 16.61,28.83 13.97,31.44 v13.97,31.75 | v35.56,72.39 30.48,77.47 24.13,77.47 22.76,76.1 22.76,65.56 20.32,63.12 HPF5INTEST.1 20.32,53.34 17.78,50.8 17.47,50.8 16.84,50.43 16.84,50.17 AI0DEMUX.12 v16.84,47.87 | v16.84,9.77 A2IDEMUX.12 | C8.2 v51.44,72.07
  Bottom 0.152: v51.44,72.07 50.99,72.39 v35.56,72.39 | v16.84,47.87 16.2,47.85 13.97,45.72 v13.97,31.75 13.97,31.34 14.58,30.73 14.58,30.23 13.97,29.62 13.97,11.43 14.36,11.04 15.56,11.04 v16.84,9.77
HPF5OUT  (via drill 0.38)
  Top 0.152: AMP0.13 v48.58,52.96 AMP0.14 | AO0MUX.12 94.58,41.63 94.87,41.63 94.94,41.91 v98.16,41.91 98.17,42.33 98.78,42.93 99.1,43.74 99.06,44.04 v99.06,50.8 v99.06,59.69 | AO2MUX.12 94.83,14.91 98.8,18.88 v98.8,19.31 | AO1MUX.12 94.37,27.61 97.11,27.61 97.11,27.65 98.12,28.62 98.49,28.98 98.49,29.76 v98.8,30.07
  Bottom 0.152: v48.58,52.96 49.22,50.8 49.22,49.84 49.53,49.53 52.38,49.52 v53.3,49.81 54.09,50.26 56.9,53 63,53 65.2,50.8 v99.06,50.8 | v98.16,41.91 98.8,40.9 v98.8,30.07 98.8,21.86 98.78,21.85 98.78,21.33 98.8,21.32 v98.8,19.31 | v99.06,59.69 100.33,59.69 HPF5OUTTEST.1
I2C1SCL  (via drill 0.38)
  Top 0.152: R28.1 U$4.17 | U$2.4 113.59,75.5 114.58,76.48 125.52,76.48 v130,72
  Bottom 0.152: U$4.17 133.06,10.45 133.06,24.02 130.52,26.56 130.56,56.05 | v130,72 129.99,59.03 131.41,57.62 131.42,56.9 130.56,56.05 | 130.56,56.05 130.52,56
I2C1SDA  (via drill 0.38)
  Top 0.152: U$4.19 137.48,8.57 R29.1 | U$2.1 103.38,63.38 104.04,62.71 104.04,61.75 104,61.71 v104,48 | v126.45,13.09 126.06,13.66 126.07,40.3 122,44.43 v122,46
  Bottom 0.152: v104,48 114.97,48 119.13,43.84 119.63,43.84 121.79,46 v122,46 | v126.45,13.09 126.95,12.41 129.95,12.41 130.52,11.84 130.52,9.73 131.1,9.15 131.1,8.48 131.67,7.91 135.03,7.91 136.01,8.89 U$4.19
I2C2SCL  (via drill 0.38)
  Top 0.152: 124.46,8.83 U$4.9 | 124.46,8.83 R26.1 | SCLMUX.3 83.04,58.71 83.33,58.71 84.43,57.47 v84.87,57.14 | 124.46,8.83 125.67,8.83 126.59,7.91 127.41,7.91 127.98,8.48 128,12.7 126.41,14.29 126.4,30.1 128.3,31.99 128.29,52.93 128.99,53.63 129.95,53.63 130.52,54.2 130.52,56.86 v130.59,57.07
  Bottom 0.152: v84.87,57.14 108.36,57.15 108.97,56.54 109.47,56.54 110.08,57.15 v130.59,57.07
I2C2SDA  (via drill 0.38)
  Top 0.152: POTA.9 32.03,62.76 32.03,63.35 31.75,63.86 31.75,69.85 v33.02,71.12 | v93.98,72.39 96.52,69.85 v96.52,48.26 | v120.9,43.15 125.73,38.1 125.73,10.16 U$4.11 | POTE.9 46.97,29.48 v45.58,29.36 45.16,27.67 45.16,25.82 45.72,25.27 v45.77,24.89 | v49.53,57.15 50.53,58.16 POTB.9 50.53,64.5 v50.8,64.77 | v41.91,52.07 41.91,43.04 41.93,43.02 41.93,42.43 POTD.9 41.93,41.95 41.93,41.36 41.91,41.34 v41.77,40.79 | v62.23,64.77 63.23,65.78 POTC.9 63.21,67.05 v63.21,71.22 | v35.4,36.88 35.41,36.58 v35.52,29.36 | POTF.9 72.35,27.96 72.94,27.96 73.08,27.83 73.08,27.28 72.94,27.15 72.87,27.15 v72.39,26.67 | v129.54,7.3 R27.1 | POT_DCOFFSET.9 31.76,19.23 31.76,18.64 31.63,18.5 31.08,18.5 30.78,18.5 29.19,19.05 29.18,22.11 29.18,25.79 v29.39,26
  Bottom 0.152: v93.98,72.39 72.77,72.39 71.6,71.22 v63.21,71.22 33.12,71.22 v33.02,71.12 | v96.52,48.26 101.6,43.18 v120.9,43.15 | v45.58,29.36 v35.52,29.36 33.16,29.36 29.81,26 v29.39,26 | v49.53,57.15 46.99,57.15 v41.91,52.07 | U$4.11 127.96,8.89 128.94,9.87 129.95,9.87 130.52,9.3 130.52,8.48 129.54,7.5 v129.54,7.3 | v62.23,64.77 60.96,63.5 59.69,63.5 58.42,62.23 51.82,62.23 51.82,63.75 v50.8,64.77 | v35.4,36.88 35.54,37.03 36.58,37.76 38.74,37.76 v41.77,40.79 | v45.77,24.89 46.38,25.4 71.12,25.4 v72.39,26.67
LPF1IN  (via drill 0.38)
  Top 0.152: 16.18,60.63 | 16.18,60.63 AI0DEMUX.13 16.18,49.2 15.7,48.72 v15.7,48.3 | POTA.3 35.91,64.42 v35.58,65.96 | A2IDEMUX.13 16.18,11.54 16.18,11.13 15.52,10.73 11.82,10.73 11.16,11.43 v10.7,11.46 | AI1DEMUX.13 16.18,27.88 16.11,27.61 14.88,26.67 v10.82,26.67 | LPF1INTEST.1 18.4,63.3 18.4,63.24 18.1,62.94 16.18,60.63
  Bottom 0.152: LPF1INTEST.1 v35.58,65.96 | v10.7,11.46 v10.82,26.67 10.82,40.47 10.81,40.48 10.81,44.71 10.82,44.72 10.82,47.24 12.08,48.5 12.08,48.52 12.44,48.88 12.96,48.88 13.58,48.26 | 13.56,48.26 13.58,48.26 | 13.58,48.26 15.7,48.26 v15.7,48.3
LPF1OUT  (via drill 0.38)
  Top 0.152: AMP0.2 AMP0.1 48.26,59.39 v48.27,59.79 | 68.61,60.99 v68.58,60.96 | v72.23,45.73 68.62,49.56 68.61,60.99 | AO2MUX.13 94.7,15.56 97.79,18.66 v97.79,19.05 | v97.87,29.24 96.84,28.27 AO1MUX.13 | v98.11,43.36 96.84,42.23 AO0MUX.13 | 68.61,60.99 68.6,66.93 69.92,67.78 69.88,71.13 LPF1OUTTEST.1
  Bottom 0.152: v48.27,59.79 49.53,60.96 v68.58,60.96 | v97.79,19.05 v97.87,29.24 97.79,41.05 97.18,41.66 97.18,42.16 98.14,42.76 v98.11,43.36 97.51,44.12 97.56,45.96 96.77,46.33 86.82,46.36 86.12,46.36 85.74,45.98 85.74,45.96 84.78,45 84.78,43.18 78.79,43.18 78.48,43.48 74.62,43.48 v72.23,45.73
LPF5IN  (via drill 0.38)
  Top 0.152: 32.83,62.67 POTA.8 32.66,64.79 v32.83,64.96 | v17.78,63.5 15.54,61.26 AI0DEMUX.14 15.51,49.05 15.06,48.6 15.03,48.06 v13.97,46.99 | AI1DEMUX.14 15.54,28.91 v13.84,30.5 | A2IDEMUX.14 15.53,11.93 15.53,12.23 13.63,13.97 v13.31,13.97
  Bottom 0.152: v13.97,46.99 13.01,46.02 13.01,30.38 | v13.84,30.5 13.1,30.48 13.01,30.38 | LPF5INTEST.1 v17.78,63.5 31.37,63.5 v32.83,64.96 | v13.31,13.97 13.31,16.51 13.09,16.78 13.07,16.88 13.07,27.25 | 13.01,27.19 13.07,27.25 | 13.07,27.25 13.36,27.55 13.31,28.24 13.01,28.55 13.01,30.38
LPF5OUT  (via drill 0.38)
  Top 0.152: AMP0.7 AMP0.6 44.42,57.18 44.45,57.15 43.18,55.88 43.18,46.99 v44.45,45.72 | v96.96,43.24 96.59,42.88 AO0MUX.14 94.13,42.91 93.83,42.91 93.62,43.28 v92.81,43.28 | v97.18,30.48 95.62,28.91 AO1MUX.14 | AO2MUX.14 94.92,16.21 97.14,18.53 v97.14,20.32 | v90.17,40.64 89.51,39.73 89.21,39.23 88.66,39.15 83.72,39.2 80.03,43.53 v80.01,45.72 80.01,50.8 v81.28,52.07 | v111.76,55.88 114.3,58.42 LPF5OUTTEST.1
  Bottom 0.152: v96.96,43.24 96.88,42.29 96.88,41.53 97.48,40.93 97.48,30.78 v97.18,30.48 v97.14,20.32 | v44.45,45.72 45.11,46.38 78.72,46.38 | 78.72,46.38 78.74,46.38 | v92.81,43.28 v90.17,40.64 | v80.01,45.72 79.38,45.72 78.72,46.38 | v81.28,52.07 109.22,52.07 109.22,53.34 v111.76,55.88
N$1
  Top 0.152: D1.A 91.43,74.88 CL_RES.1
N$2  (via drill 3.05 pad 7.62)  (4 unrouted)
  other vias: 11.05,74.86 100.07,5.56 123.58,63.11 5.24,8.77 134.85,41.87
N$5  (via drill 0.38)
  other vias: 136,20
N$6  (via drill 0.38)
  other vias: 138,64
N$7  (via drill 0.38)
  other vias: 136,78
N$136  (via drill 0.38)
  Top 0.152: R10.1 60.96,37.72 AMP1.9 60.93,38.54 60.42,39.05 R8.2 58.42,60.96 v59.69,62.23
N$140
  Top 0.152: AMP1.13 63.26,37.45 63.26,36.72 61.94,35.4 61.94,34.49 61.73,34.29 59.69,34.29 58.42,33.02 58.42,29.21 59.69,27.94 R11.1 R9.1
N$142
  Top 0.152: AMP2.5 53.88,13.36 56.16,13.36 57.92,11.43 R12.1 57.12,10.45 55.45,10.45 55.16,10.75 AMP2.1
N$143
  Top 0.152: R12.2 56.17,11.4 AMP2.2 53.39,11.41 53.07,11.41 51.94,9.95 R30.2
NCPOT
  Top 0.152: SCLMUX.4 90.8,59.37 R15.2
NODEA  (via drill 0.38)
  Top 0.152: AMP0.10 45.08,53.56 45.34,53.71 45.72,53.93 v45.78,54.17 | v50.8,55.88 53.34,58.42 v53.35,65.75 53.34,67.31 51.79,68.86 POTB.11 | POTB.17 | POTB.17 v47.28,67.46 | C7.1 26.67,64.45 HPF1PREAMPTEST.1 | v46.99,73.66 47.28,73.36 POTB.17
  Bottom 0.152: v45.78,54.17 47.61,55.88 v50.8,55.88 | v47.28,67.46 49.09,66.04 v53.35,65.75 | HPF1PREAMPTEST.1 v46.99,73.66
NODEB  (via drill 0.38)
  Top 0.152: AMP0.12 v46.37,51.71 46.08,51.28 POTD.3 v46.06,40.86 | v42.83,40.79 42.83,41.17 POTD.8 42.81,45.91 v42.6,46.31 | HPF5PREAMPTEST.1 v13.97,58.42 | v25.4,57.15 25.4,48.92 v28.43,45.82 | C12.1 55.88,69.44 55.27,68.83 55.27,68.33 55.88,67.72 v55.88,57.15
  Bottom 0.152: v55.88,57.15 53.34,54.61 48.26,54.61 47.22,53.57 46.8,53.57 46.37,53.14 v46.37,51.71 | v25.4,57.15 24.13,58.42 v13.97,58.42 | v28.43,45.82 v42.6,46.31 | v42.83,40.79 42.98,40.64 45.92,40.64 v46.06,40.86
NODEC  (via drill 0.38)
  Top 0.152: POTD.11 v41.47,37.95 41.47,38.93 v41.91,39.37 | POTD.17 45.42,38.4 v44.44,39.38 | v36.83,35.5 C13.1
  Bottom 0.152: v36.83,35.5 38.57,36.55 40.07,36.55 v41.47,37.95 | v44.44,39.38 41.92,39.38 v41.91,39.37
NODED
  Top 0.152: POTF.3 72.35,32.35 72.94,32.35 74.93,34.34 74.93,34.49 | 74.93,34.49 C17.1 | POTF.8 74.58,28.86 74.93,29.21 74.93,34.49
NODEE  (via drill 0.38)
  Top 0.152: 35.34,10.16 R24.2 | 35.34,10.16 37.78,10.16 C22.1 38.1,11.43 v38.86,12.19 | 35.34,10.16 34.43,11.2 33.59,11.2 33.09,11.2 32.28,12 30,12 27.08,14.92 27.08,16.51 v22.86,16.51 10.16,16.51 8,16 8,14 9.44,12.41 9.44,6.29 7.26,4.12 60HZPREAMPTEST.1 | v45.59,12.82 46.33,13.35 AMP2.10
  Bottom 0.152: v38.86,12.19 43.42,12.82 v45.59,12.82
NODEF
  Top 0.152: R24.1 32.07,10.16 R23.2 31.9,8.61 32.47,7.98 32.51,7.33 C23.1
NODEG
  Top 0.152: C21.1 R25.1 34.61,5.26 34.36,5.5 34.36,7.2 35.11,7.94 C22.2
PASSTHRUIN  (via drill 0.38)
  Top 0.152: v12.7,7.62 14.88,7.62 16.18,6.68 16.19,6.52 A2IDEMUX.4 16.19,6.5 16.18,6.75 16.26,6.83 v16.51,7.62 | AI1DEMUX.4 16.22,22.75 16.22,23.05 13.61,25.4 v12.08,25.36 | PASSTHRUTEST.1 10.16,68.58 4.76,62.1 4.76,51.94 10.19,45.92 v11.91,45.91 14.87,45.9 15.16,46 16,46 16.18,45.81 AI0DEMUX.4 | v20.32,7.62 v31.75,7.62 | v44.45,8.89 47.16,11.38 47.16,11.65 47.25,12.03 47.54,12.03 AMP2.12
  Bottom 0.152: v12.7,7.62 12.03,8.22 12.08,8.27 12.08,11.69 | v16.51,7.62 16.92,7.62 17.53,7.01 18.03,7.01 18.64,7.62 v20.32,7.62 | v31.75,7.62 33.02,8.89 v44.45,8.89 | 12.08,11.69 v12.08,25.36 12.05,25.38 12.05,44.71 11.91,44.85 v11.91,45.91 | 12.08,11.69
PASSTHRUOUT  (via drill 0.38)
  Top 0.152: AO2MUX.4 88.38,15.55 88.02,15.81 87.89,15.95 87.89,16.21 v87.53,16.55 | v87.53,26.58 87.64,27.03 87.89,27.89 88.27,28.27 AO1MUX.4 88.77,28.25 89.06,28.25 89.24,28.64 89.24,30.48 87.63,32.1 v87.63,32.44 | AMP2.13 AMP2.14 50.8,7.62 80.01,7.62 81.28,8.89 v82.55,8.89 | v87.46,42.93 87.89,42.88 87.89,42.62 88.27,42.23 AO0MUX.4
  Bottom 0.152: v87.53,26.58 88.29,25.96 88.29,21.34 88.9,20.73 88.9,19.05 87.58,17.73 v87.53,16.55 87.58,13.92 v82.55,8.89 | v87.63,32.44 87.63,40.08 87.58,40.63 v87.46,42.93
S0INPUT
  Top 0.152: AI0DEMUX.3 15.54,44.73 15.21,45.06 14.89,45.06 11.7,45.06 11.69,45.07 11.17,45.07 11.16,45.06 7.62,45.06 7.01,44.44 SENSOR0INPUT.1
  Bottom 0.152: S0INPUT.3 2.54,54.26 1.82,53.17 1.82,47.46 SENSOR0INPUT.1
S1INPUT
  Top 0.152: AI1DEMUX.3 15.53,22.77 15.53,23.06 15.15,23.2 7.28,23.2 4.45,25.65 3.81,26.29 3.81,36.83 5.46,38.48 | 5.46,38.48 SENSOR1INPUT.1 | S1INPUT.3 3.09,41.31 5.46,38.48
S2INPUT  (via drill 0.38)
  Top 0.152: A2IDEMUX.3 15.52,5.6 15.35,5.33 12.36,2.54 v9.87,2.42
  Bottom 0.152: 8.11,30.93 8.13,30.86 | 8.11,30.93 SENSOR2INPUT.1 | 8.11,30.93 8.18,30.79 8.16,22.59 | S2INPUT.3 7.89,22.13 8.16,22.59 | 8.16,22.59 8.28,17.8 8.27,17.78 8.27,13.32 8.59,11.13 9.28,10.44 9.28,7.09 9.2,7.01 v9.87,2.42
SCLA  (via drill 0.38)
  Top 0.152: SCLMUX.13 77.32,59.38 77.62,59.38 77.81,59.74 77.81,62.23 77.47,62.58 77.47,64.77 v75.11,64.9 R22.2 | POTA.14 33.33,57.2 33.33,57.78 33.69,57.84 33.71,57.84 v34.29,58.42
  Bottom 0.152: v34.29,58.42 34.95,59.08 48.51,59.08 49.12,59.69 71.12,59.69 75.11,63.8 v75.11,64.9
SCLB  (via drill 0.38)
  Top 0.152: POTB.14 49.23,68.66 49.23,68.07 48.86,67.89 48.84,67.89 v48.47,67.52 | v79.42,66.05 79.92,66.08 80.44,65.75 81.09,65.09 R21.2 79.3,63.11 79.3,62.66 79.17,62.52 79.03,62.52 78.74,62.23 78.12,60.87 78.12,58.93 77.91,58.72 SCLMUX.14
  Bottom 0.152: 48.68,67.31 v48.47,67.52 49.96,66.34 52.79,66.34 53.09,66.65 55.69,66.65 56.9,65.43 74.22,65.43 74.85,66.06 75.61,66.06 75.63,66.04 78.74,66.04 78.91,66.03 v79.42,66.05
SCLC  (via drill 0.38)
  Top 0.152: SCLMUX.15 76.76,58.06 75.71,59.4 74.26,59.81 74.16,65.74 74.33,68.62 v76.2,69.85 76.52,70.17 R20.2 | POTC.14 61.92,72.46 61.92,71.88 62.23,71.79 v62.24,70.51
  Bottom 0.152: v62.24,70.51 62.99,69.85 v76.2,69.85
SCLD  (via drill 0.38)
  Top 0.152: SCLMUX.12 75.84,59.93 74.8,60.33 v74.87,62.48 75.89,63.5 R19.2 | POTD.14 | POTD.14 v43.49,37.96 | v73.07,63.5 73.28,57.03 73.59,56.73 73.59,41.98 v73.66,41.91
  Bottom 0.152: v73.66,41.91 72.39,40.64 47.15,40.54 46.04,39.59 46.01,38.95 v43.49,37.96 | v74.87,62.48 76.22,64.18 76.22,65.02 75.48,65.76 74.98,65.76 74.37,65.15 74.37,64.47 v73.07,63.5
SCLE  (via drill 0.38)
  Top 0.152: R18.2 83.11,62.62 80.98,62.64 80.85,62.64 80.31,62.1 80.31,58.73 | 80.31,58.73 | 80.31,58.73 81.62,57.41 SCLMUX.1 82.81,57.41 v83.19,56.52 | POTE.14 53.86,31.02 54.45,31.02 54.59,31.15 54.59,31.7 54.56,31.72 55.88,33.04 55.88,49.53 v57.15,50.8 | v63.5,50.8 64.77,52.07 v64.77,55.88
  Bottom 0.152: v57.15,50.8 v63.5,50.8 | v64.77,55.88 66.04,57.15 82.55,57.15 v83.19,56.52
SCLF  (via drill 0.38)
  Top 0.152: POTF.14 77.51,29.75 76.92,29.75 76.78,29.88 76.78,30.43 76.81,30.45 76.2,31.05 75.63,31.05 75.23,31.45 75.23,33.98 76.2,34.95 76.2,54.61 | 76.2,54.61 78.79,57.2 v78.85,59.85 | v81.4,60.02 SCLMUX.5 | 76.2,54.61 74.93,55.88 R17.2
  Bottom 0.152: v78.85,59.85 79.06,60.02 v81.4,60.02
SCLG  (via drill 0.38)
  Top 0.152: v33.22,15.44 33.22,15.01 33.27,14.96 33.27,13.82 | 33.27,13.82 33.27,13.73 | 33.34,28.2 v33.34,28.32 | 33.34,28.2 34.29,28.89 34.28,43.17 v35.56,44.45 | 84.12,47.36 84.12,47.35 | 84.12,47.36 84.12,54.91 84.1,56.37 83.74,57 83.56,57.41 83.56,57.69 83.43,57.82 83.28,58.06 SCLMUX.2 | 33.34,28.2 33.34,26.92 R16.2 33.27,26.6 v33.27,24.64 | POT_DCOFFSET.14 33.28,13.83 33.27,13.82 | v83.48,46.26 83.48,46.71 84.12,47.36
  Bottom 0.152: v33.22,15.44 33.34,15.56 33.27,15.63 v33.27,24.64 | v35.56,44.45 36.89,45.78 42.97,45.61 43.68,46.69 82.93,46.83 82.93,46.81 v83.48,46.26
SCLS0  (via drill 0.38)
  Top 0.152: SCLMUX.11 77.14,60.62 v76.1,60.58 | v120.65,50.12 114.36,50.19 108.5,56.05 v108.5,58.46
  Bottom 0.152: v76.1,60.58 78.4,58.42 v108.5,58.46 | v120.65,50.12 121.92,51.46 U$4.27
SCLS1  (via drill 0.38)
  Top 0.152: SCLMUX.10 77.06,61.24 v75.47,61.3 | v107.79,59.1 107.82,58.8 107.85,58.66 107.85,55.94 113.91,49.91 114.2,49.91 114.23,49.89 114.55,49.56 120.39,49.49 120.91,49.49 121.22,49.47 v121.98,49.12
  Bottom 0.152: v107.79,59.1 107.18,58.9 78.94,58.86 76.39,61.3 v75.47,61.3 | v121.98,49.12 U$4.29
SCLS2  (via drill 0.38)
  Top 0.152: SCLMUX.9 77.02,61.85 v76.09,62.1 | v109.23,57.21 113.32,53.05 113.32,51.66 114.18,50.8 125.73,50.8 U$4.31
  Bottom 0.152: v109.23,57.21 108.92,57.15 107.95,58.12 77.81,58.12 77.58,58.36 76.16,59.69 75.99,59.83 75.69,60.02 74.84,60.86 | v76.09,62.1 75.96,61.98 75.24,61.98 | 75.13,61.86 75.24,61.98 | 75.24,61.98 75.24,61.95 74.84,61.55 74.84,60.86 | 74.84,60.86 74.84,60.84
SSIOCLK  (via drill 0.38)
  Top 0.152: U$4.40 136.01,54.61 135.03,53.63 131.67,53.63 131.1,54.2 131.1,55.02 131.42,55.34 131.42,57.4 131.06,57.76 130.24,57.76 v130,58 | v116,60 116,74.45 U$1.1
  Bottom 0.152: v130,58 118,58 v116,60
SSIOFSS
  Top 0.152: U$4.38 134.62,63.83 U$1.5
SSIORX
  Top 0.152: U$4.36 132.08,62.37 U$1.3
SSIOTX  (via drill 0.38)
  Top 0.152: U$1.2 118,74.45 v118,56 | v118,48 120.04,45.96 120.04,28.14 123.61,24.54 v122.65,21.81
  Bottom 0.152: v118,56 v118,48 | U$4.15 132.08,10.04 131.1,11.02 131.1,13.1 v122.65,21.81
STAGE1OUT  (via drill 0.38)
  Top 0.152: v74.93,39.3 C17.2 | v58.42,35.5 R8.1 58.99,37.72 AMP1.8
  Bottom 0.152: v74.93,39.3 74.49,39.69 74.04,39.75 62.2,39.75 61.21,38.76 60.03,38.76 R8.1 v58.42,35.5
STAGE2OUT  (via drill 0.38)
  Top 0.152: C19.2 40.98,19.71 v43.18,19.71 | v62.23,21.59 62.23,25.9 63.43,27.09 63.43,29.46 64.37,30.4 | 64.37,30.4 R9.2 | AMP1.14 66,36 66,32 64.37,30.4
  Bottom 0.152: v43.18,19.71 43.79,20.32 60.96,20.32 v62.23,21.59

## Text on the board
tNames: sdmay18-31 / PCB Rev III | This board is to be used to bring in analog / and digital sensor input, pass through either / analog or digital sensors, and send data / into a mounted Launchpad, for use in EE 224